# EAGLE design LB_BIT_i19_ROLLERSWITCH-v03(rev3) (EAGLE 6.6.0)
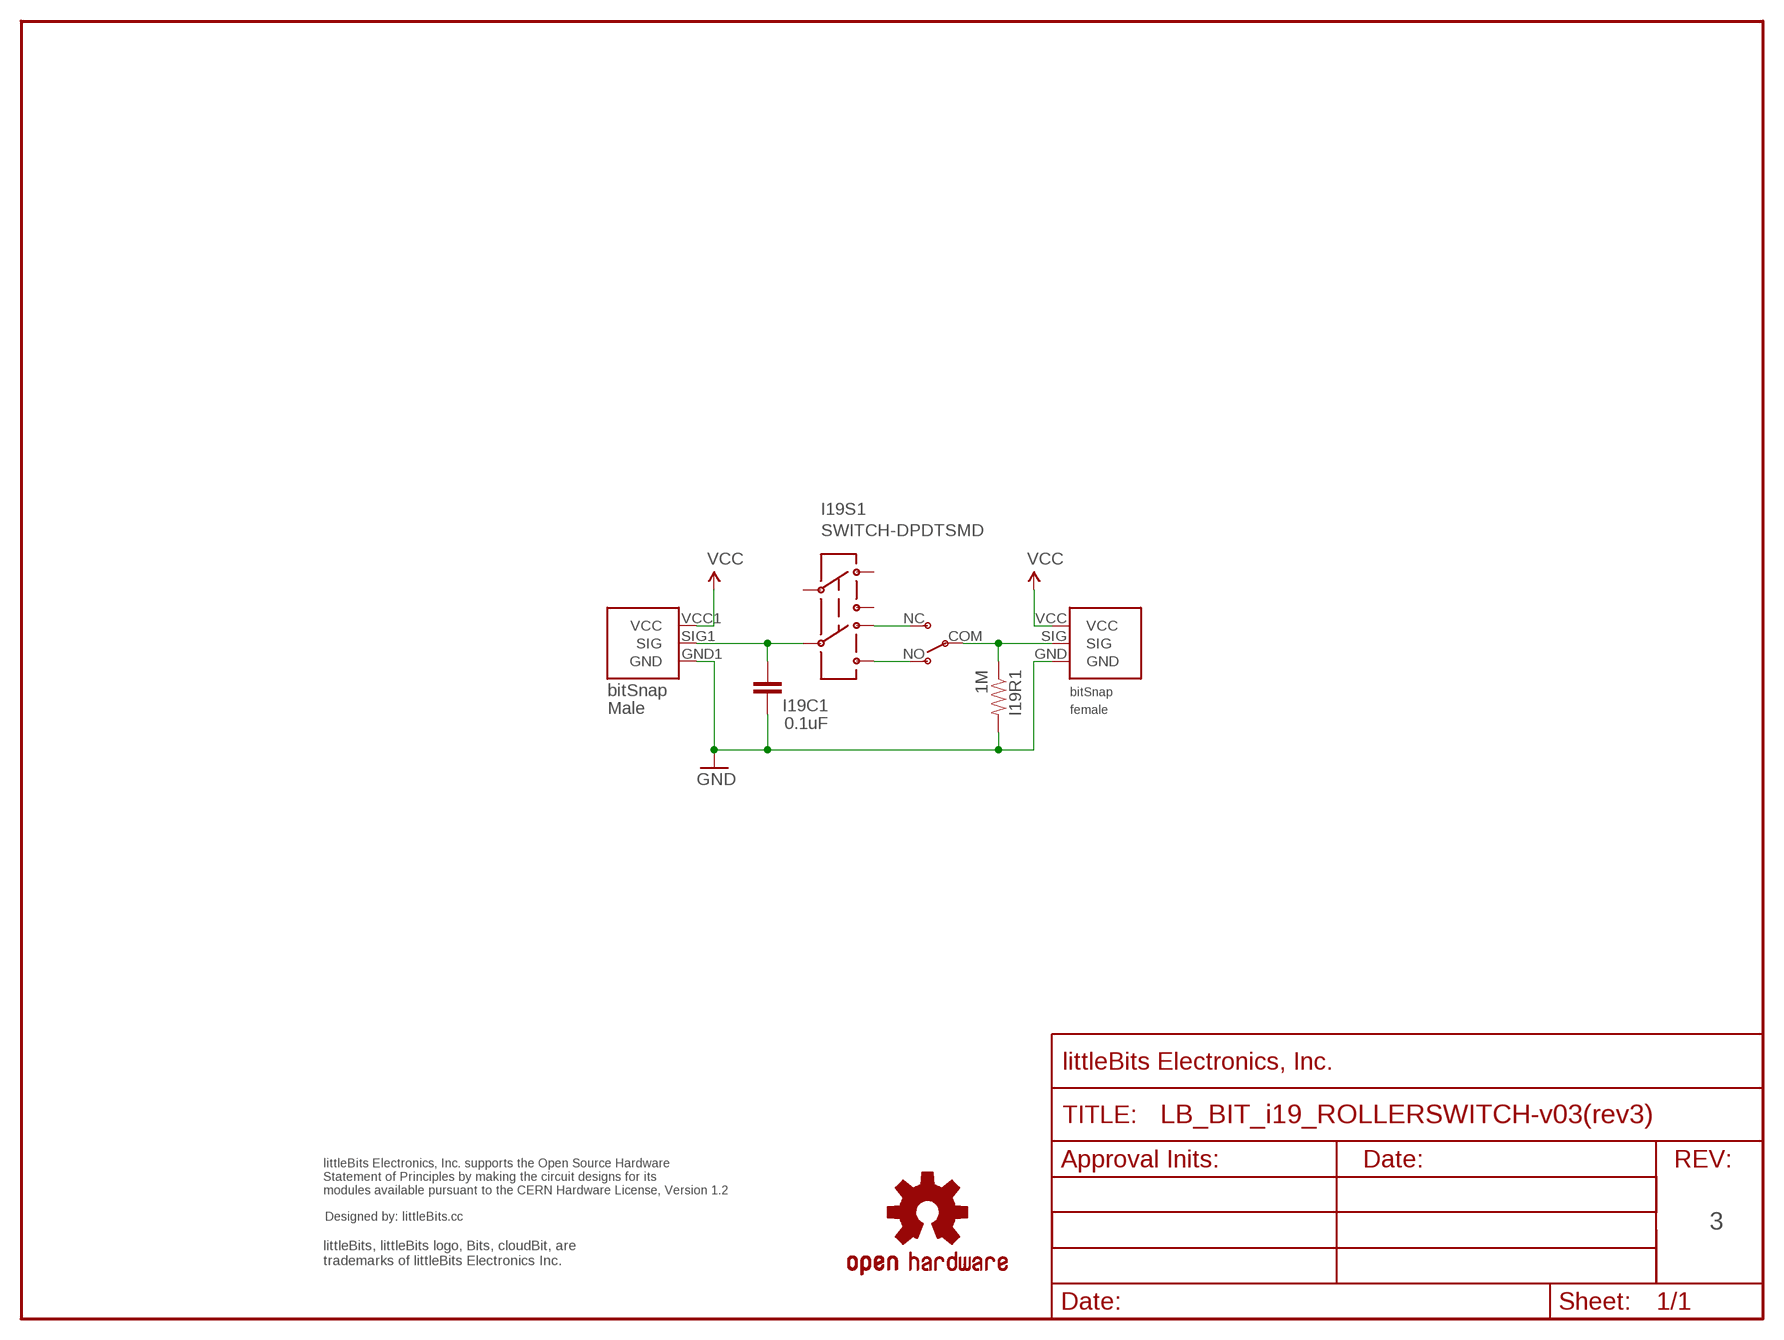
[diagram p0: schematic, sheet 1]

## Parts
FRAME1  FRAME-LETTER-OHWOHW  [FABDWG01-OHW]
I19BSF1  BITSNAP_V03_FEMALE  [BITSNAP_V03_FEMALE]
I19BSM1  BITSNAP_V03_MALE  [BITSNAP_V03_MALE]
I19C1  0.1uF  CAP0603-CAP  [0603-CAP]
I19R1  1M  RESISTOR0603-RES  [0603-RES]
I19S1  SWITCH-DPDTSMD  [AYZ0202]
I19SW2  ROLLERSWITCH-OMRON-SS-5GL2DRIGHTANGLE  [ROLLERSWITCH-OMRON-D2F-01FL-A]
U$1  OSHWCREDIT  [OSHWCREDIT]
U$3  OSHW-LOGOL  [OSHW-LOGO-L]

## Nets
GND: I19BSF1.GND I19BSM1.GND1(GND) I19C1.1 I19R1.2
N$1: I19S1.4 I19SW2.NC
N$2: I19S1.6 I19SW2.NO
SIG: I19BSM1.SIG1(SIG) I19C1.2 I19S1.5
SIG2: I19BSF1.SIG I19R1.1 I19SW2.COM
VCC: I19BSF1.VCC I19BSM1.VCC1(VCC)
Unconnected: I19S1.1 I19S1.2 I19S1.3

## Notes on the sheet
- 3

## Library data of the parts
FRAME1 = LITTLEBITS:FRAME-LETTER-OHW
I19BSF1 = bitSnap:BITSNAP_V03_FEMALE
I19BSM1 = bitSnap:BITSNAP_V03_MALE
I19C1 = SparkFun:CAP: Capacitor Standard 0603 ceramic capacitor, and 0.1" leaded capacitor.
I19R1 = SparkFun:RESISTOR: Resistor Basic schematic elements and footprints for 0603, 1206, and PTH 1/10th watt (small) resistors.
I19S1 = SparkFun:SWITCH-DPDT: DPDT Version of the COM-00597
I19SW2 = LITTLEBITS:ROLLERSWITCH-OMRON-SS-5GL2D
U$1 = LITTLEBITS:OSHWCREDIT
U$3 = SparkFun_NEW:OSHW-LOGO: Open Source Hardware Logo This logo indicates the piece of hardware it is found on incorporates a OSHW license and/or adheres to the definition of open source hardware found here: http://freedomdefined.org/OSHW

## Board
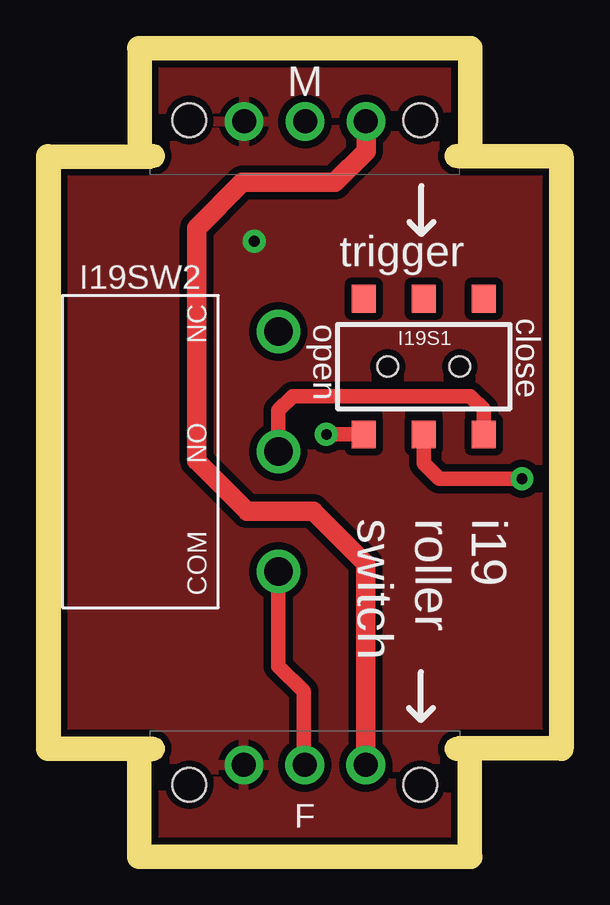
[diagram p1: board, top side]
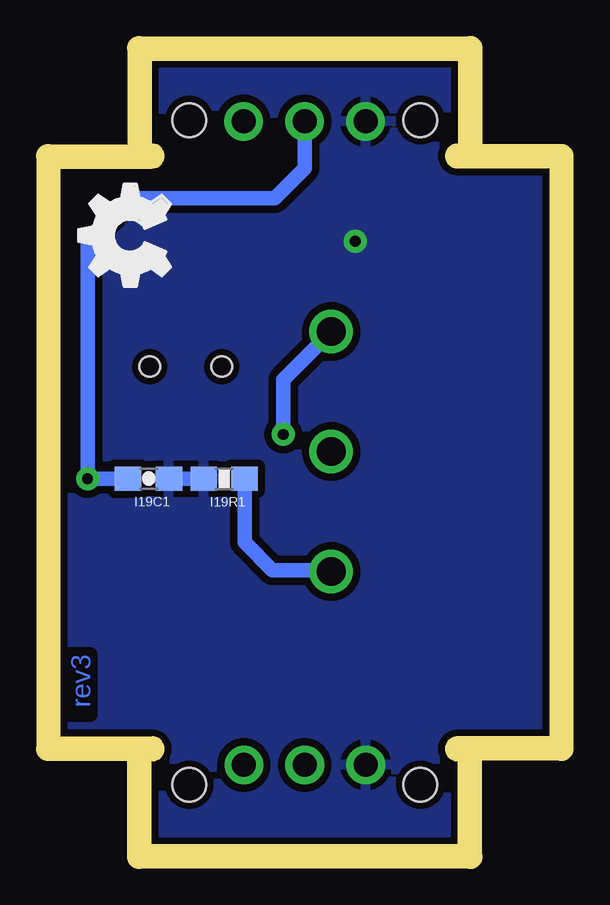
[diagram p2: board, bottom side, seen from below]

Size 20.4 x 32.7 mm. Coordinates in mm from the lower left corner, seen from the top.
Outline: 0,28.2 0,4.5
Outline: 20.4,4.5 20.4,28.2
Copper layers (1*16): Top 0.035mm / dielectric 1.5mm / Bottom 0.035mm
Design rules "default": minimum track width 8mil, minimum drill 20mil, track to track 8mil, track to pad 8mil, pad to pad 8mil, via to via 8mil, smd to smd 8mil, copper to edge 10mil, drill to drill 8mil, minimum pad ring 12mil, minimum via ring 10mil, stop-mask expansion 4mil, vias tented up to drill 25mil, thermal gap 10mil
Milling: 2 lines

### Footprints (pad centres in the part's own frame; a part is rotated, then mirrored left to right if it is on the bottom)
BITSNAP_V03_FEMALE = drill 1: GND 3.91,3.33; SIG 6.45,3.33; VCC 8.99,3.33 | hole 1.4: 1.63,2.5; 11.27,2.5
BITSNAP_V03_MALE = drill 1: GND1 8.98,2.56; SIG1 6.44,2.56; VCC1 3.9,2.56 | hole 1.4: 11.27,2.5; 1.63,2.5
0603-CAP = smd 1.1 x 1: 1 -0.85,0; 2 0.85,0
0603-RES = smd 1.1 x 1: 1 -0.85,0; 2 0.85,0
AYZ0202 = smd 1 x 1.15: 1 -2.5,2.825; 2 0,2.825; 3 2.5,2.825; 4 -2.5,-2.825; 5 0,-2.825; 6 2.5,-2.825 | hole 0.85: 1.5,0; -1.5,0
ROLLERSWITCH-OMRON-D2F-01FL-A = drill 1.2: COM 1.5,-2.5; NC 11.5,-2.5; NO 6.5,-2.5

### Placement (x,y rotation side)
FRAME1  0,0 0 top
I19BSF1  3.75,0 0 top
I19BSM1  16.65,32.7 180 top
I19C1  16.71,15.26 180 bottom
I19R1  13.56,15.25 180 bottom
I19S1  15.15,19.93 0 top
I19SW2  6.6,9.89 90 top
U$1  -93.5,-63.6 0 top  (outside the outline)
U$3  -33.57,-69.13 0 top  (outside the outline)
U$20  [OSHW_FILLX150_NOTEXT]  15.8,22.43 0 top

### Tracks (layer width: path | path; a pad name or v marks a point on that pad's centre or on a via)
GND  (via drill 0.45)
  Bottom 0.61: I19R1.2 I19C1.1
  other vias: 8.1,25.15
  pour Top (isolate 0.305): 0.22,32.48 20.18,32.48 20.18,0.22 0.22,0.22
  pour Bottom (isolate 0.305): 0.22,32.48 20.18,32.48 20.18,0.22 0.22,0.22
N$1  (via drill 0.45)
  Top 0.61: I19S1.4 v11.1,17.1
  Bottom 0.61: v11.1,17.1 11.1,19.39 I19SW2.NC
N$2
  Top 0.61: I19S1.6 17.66,18.14 17.1,18.7 9.7,18.7 9.1,18.1 I19SW2.NO
SIG  (via drill 0.45)
  Top 0.61: I19S1.5 15.15,15.89 15.8,15.25 v19.25,15.25
  Bottom 0.61: I19C1.2 v19.25,15.25 19.25,25.2 17.5,26.95 11.45,26.95 10.21,28.19 I19BSM1.SIG1
SIG2
  Top 0.61: I19SW2.COM 9.1,7.45 10.15,6.4 10.15,3.38 I19BSF1.SIG
  Bottom 0.61: I19R1.1 12.71,12.61 11.55,11.45 9.16,11.45 I19SW2.COM
VCC
  Top 0.813: I19BSF1.VCC 12.74,11.71 10.55,13.9 7.8,13.9 5.7,16 5.7,25.7 7.6,27.6 11.45,27.6 12.75,28.9 I19BSM1.VCC1

### Text on the board
Bottom: rev3
tPlace: trigger | open | close | switch | roller | i19
tNames: I19SW2
Milling: 1mm DIA. ROUTER PATH
Reference: LARGE